# Altium schematic sheet wrist_band.SchDoc
size A4; SheetNumber: 1; SheetTotal: 1
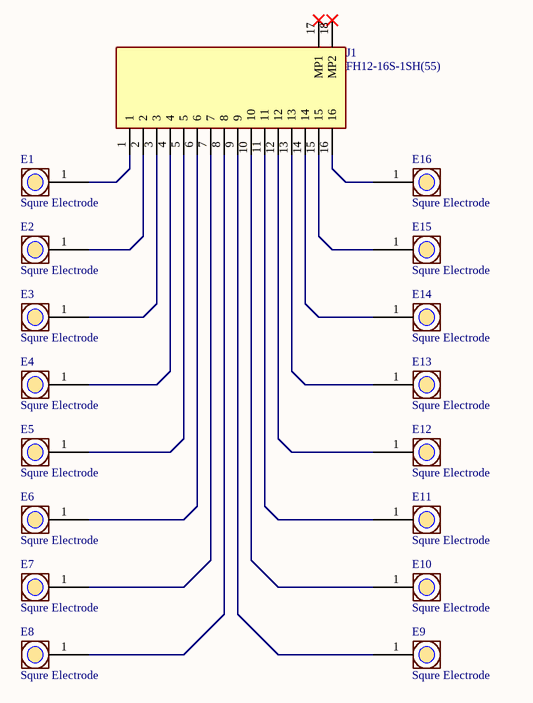
[diagram p0: wrist_band.SchDoc]

## Parts
E1  Squre Electrode  [E]
E2  Squre Electrode  [E]
E3  Squre Electrode  [E]
E4  Squre Electrode  [E]
E5  Squre Electrode  [E]
E6  Squre Electrode  [E]
E7  Squre Electrode  [E]
E8  Squre Electrode  [E]
E9  Squre Electrode  [E]
E10  Squre Electrode  [E]
E11  Squre Electrode  [E]
E12  Squre Electrode  [E]
E13  Squre Electrode  [E]
E14  Squre Electrode  [E]
E15  Squre Electrode  [E]
E16  Squre Electrode  [E]
J1  FH12-16S-1SH(55)  [FH12-16S-1SH(55)]

## Nets
NetE1_1: E1.1 J1.1
NetE2_1: E2.1 J1.2
NetE3_1: E3.1 J1.3
NetE4_1: E4.1 J1.4
NetE5_1: E5.1 J1.5
NetE6_1: E6.1 J1.6
NetE7_1: E7.1 J1.7
NetE8_1: E8.1 J1.8
NetE9_1: E9.1 J1.9
NetE10_1: E10.1 J1.10
NetE11_1: E11.1 J1.11
NetE12_1: E12.1 J1.12
NetE13_1: E13.1 J1.13
NetE14_1: E14.1 J1.14
NetE15_1: E15.1 J1.15
NetE16_1: E16.1 J1.16

Not connected (* = marked no-connect by the designer): J1 17(MP1)* 18(MP2)*

## Library data of the parts
E1-E16 = E